# Altium schematic sheet Dionysus_Buttons_LEDs.SchDoc: Leds and Buttons
size B; CompanyName: Cospan Design; DrawnBy: David McCoy; Engineer: David McCoy; DocumentNumber: 7; Revision: B; SheetNumber: 7; SheetTotal: 8
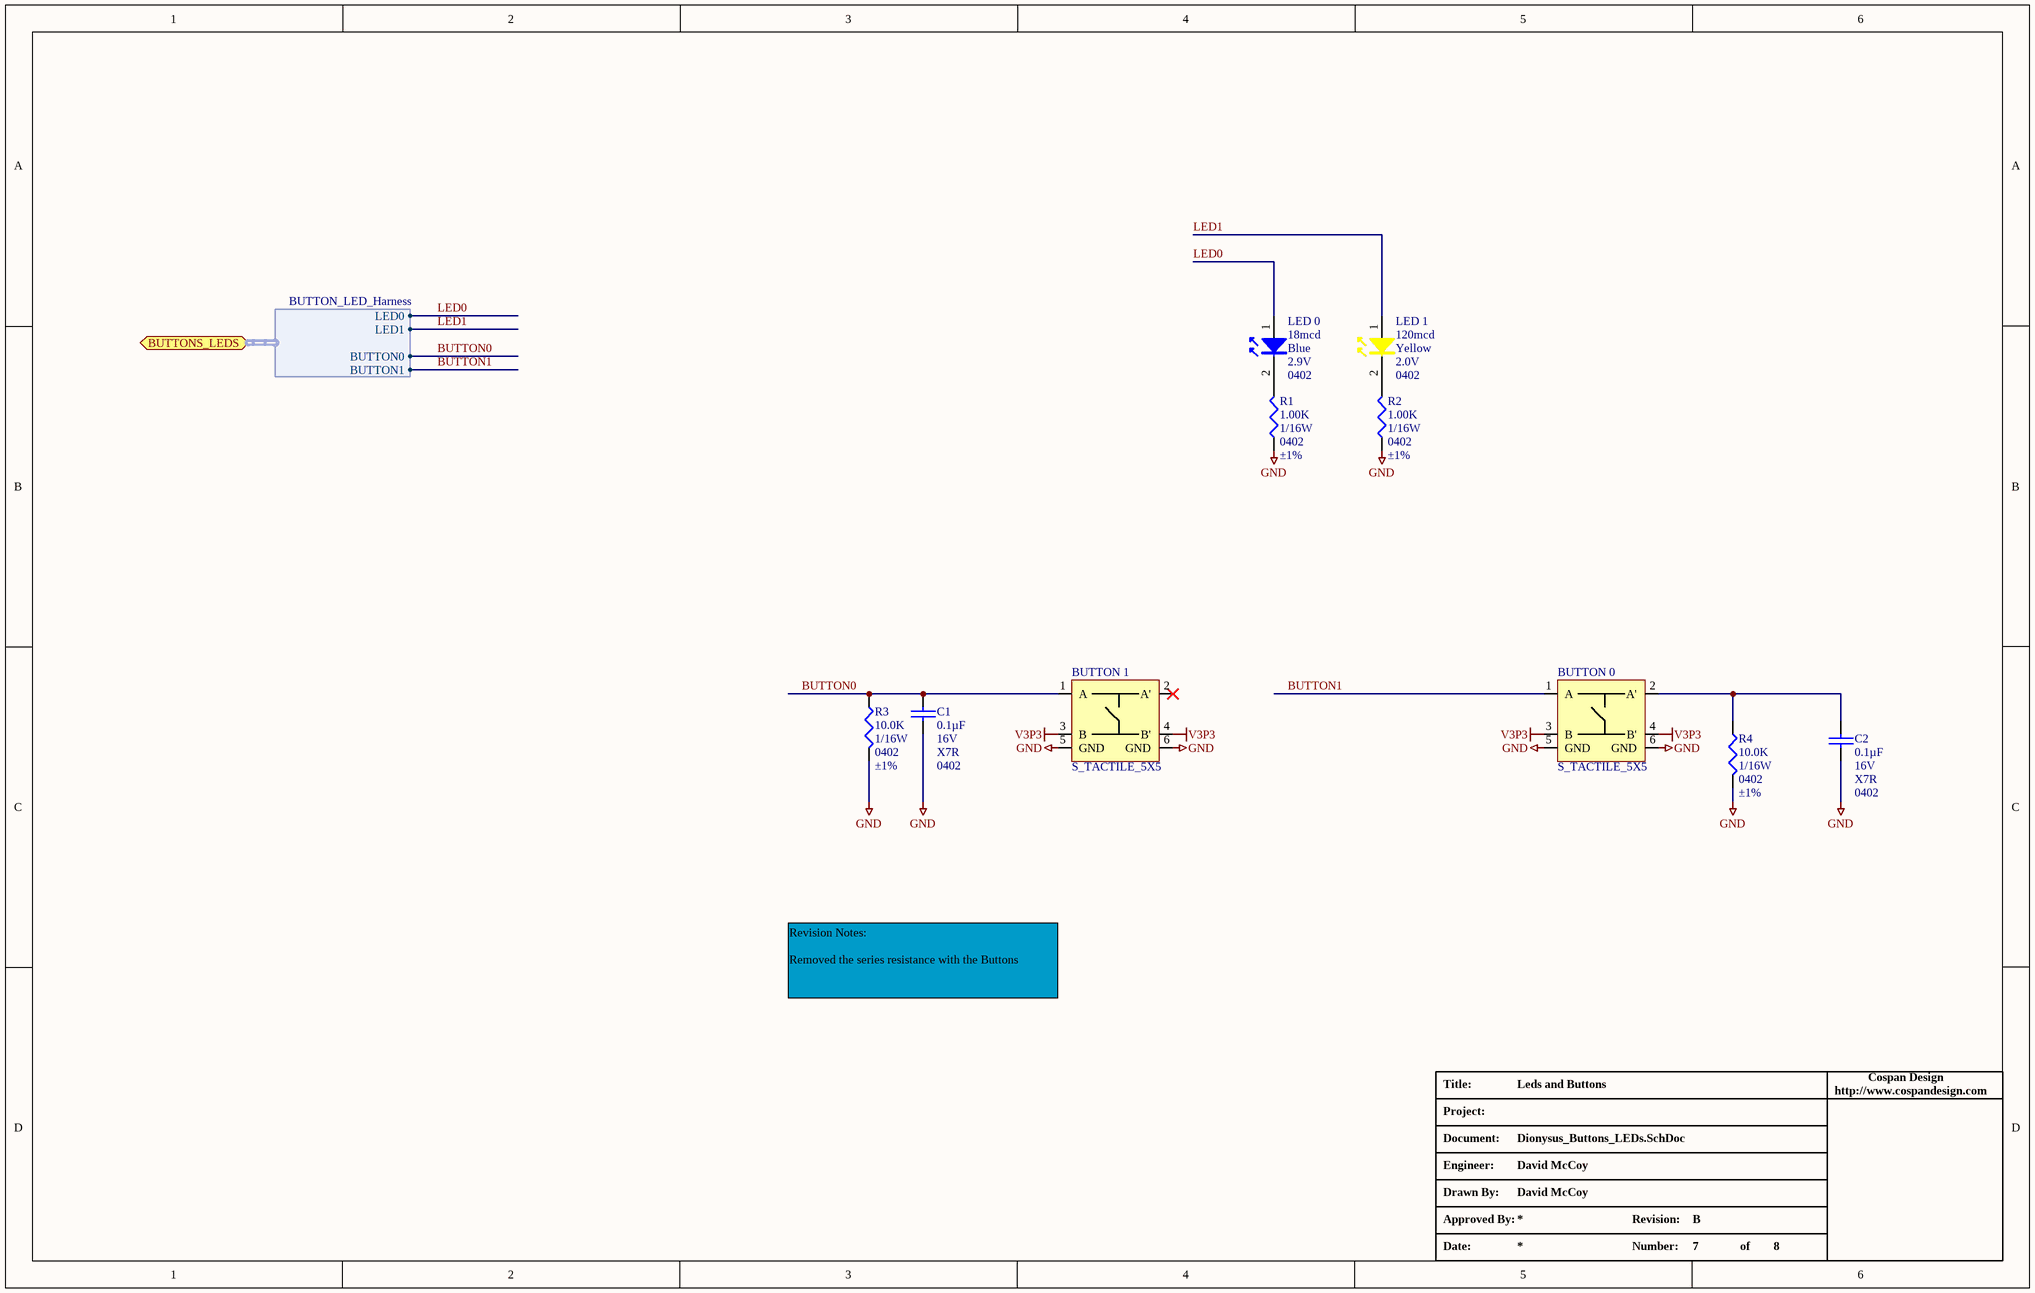
[diagram p0: Dionysus_Buttons_LEDs.SchDoc]

## Parts
BUTTON_0  S_TACTILE_5X5  [TACTILE_BUTTON_5X5]
BUTTON_1  S_TACTILE_5X5  [TACTILE_BUTTON_5X5]
C1  Capacitance: 0.1µF  Voltage - Rated: 16V  Temperature Coefficient: X7R  Package / Case: 0402  [C_ERA-0402]  (hidden comment: 0.1uF)
C2  Capacitance: 0.1µF  Voltage - Rated: 16V  Temperature Coefficient: X7R  Package / Case: 0402  [C_ERA-0402]  (hidden comment: 0.1uF)
LED_0  Luminous Flux @ Current - Test: 18mcd  Color: Blue  Voltage - Forward (Vf) Typ: 2.9V  Package / Case: 0402  [DIOM1005X07L_BLUE]  (hidden comment: LED_BLUE_0402)
LED_1  Millicandela Rating: 120mcd  Color: Yellow  Voltage - Forward (Vf) Typ: 2.0V  Package / Case: 0402  [DIOM1005X07L_YELLOW]  (hidden comment: LED_YLW_0402)
R1  Resistance In Ohms: 1.00K  Power (Watts): 1/16W  Case: 0402  Tolerance: ±1%  [ERA-0402]  (hidden comment: 1.0k Ohms)
R2  Resistance In Ohms: 1.00K  Power (Watts): 1/16W  Case: 0402  Tolerance: ±1%  [ERA-0402]  (hidden comment: 1.0k Ohms)
R3  Resistance In Ohms: 10.0K  Power (Watts): 1/16W  Case: 0402  Tolerance: ±1%  [ERA-0402]  (hidden comment: R_0402_10.0K)
R4  Resistance In Ohms: 10.0K  Power (Watts): 1/16W  Case: 0402  Tolerance: ±1%  [ERA-0402]  (hidden comment: R_0402_10.0K)

## Ports
BUTTONS_LEDS (harness BUTTON_LED_Harness)

## Harnesses
BUTTON_LED_Harness: LED0, LED1, BUTTON0, BUTTON1

## Nets
GND: BUTTON_0.5(GND) BUTTON_0.6(GND) BUTTON_1.5(GND) BUTTON_1.6(GND) C1.1 C2.1 R1.2 R2.2 R3.1 R4.1
V3P3: BUTTON_0.3(B) BUTTON_0.4(B') BUTTON_1.3(B) BUTTON_1.4(B')
BUTTON0: BUTTON_1.1(A) C1.2 R3.2 ; port BUTTONS_LEDS.BUTTON0
BUTTON1: BUTTON_0.1(A) ; port BUTTONS_LEDS.BUTTON1
LED0: LED_0.1 ; port BUTTONS_LEDS.LED0
LED1: LED_1.1 ; port BUTTONS_LEDS.LED1
NetBUTTON_0_2: BUTTON_0.2(A') C2.2 R4.2
NetLED_0_2: LED_0.2 R1.1
NetLED_1_2: LED_1.2 R2.1

Not connected (* = marked no-connect by the designer): BUTTON_1 2(A')*

## Notes on the sheet
- Revision Notes:
  Removed the series resistance with the Buttons
- Title:
- http://www.cospandesign.com
- Cospan Design
- Project:
- Document:
- Engineer:
- Drawn By:
- Approved By:
- Revision:
- Date:
- Number:
- of

## Library data of the parts
BUTTON_0 BUTTON_1 = S_TACTILE_5X5: SWITCH LT 1.5MM HT 160GF SMD; Manufacturer: Panasonic - ECG; Manufacturer Part Number: EVQ-PLHA15; Circuit: SPST-NO; Switch Function: Off-Mom; Contact Rating @ Voltage: 0.02A @ 15VDC; Actuator Type: Standard; Outline: 4.90mm x 4.90mm; Illumination: Non-Illuminated; Supplier 1: Digi-Key; Supplier Part Number 1: P8046SCT-ND; RoHS: RoHS Compliant; Category: Switches; Stock 1: 86833; Pricing: 1=0.53, 10=0.443, 100=0.3717, 500=0.3186, 1000=0.2655 (USD); Mounting Type: Surface Mount; Orientation: Vertical; Operating Force: 160gf; Packaging: Cut Tape (CT); ComponentLink1URL: http://industrial.panasonic.com/www-data/pdf/ATK0000/ATK0000CE3.pdf; ComponentLink1Description: http://industrial.panasonic.com/www-data/pdf/ATK0000/ATK0000CE3.pdf
C1 C2 = C_0402_0.1UF_16V: CAP CER .10UF 16V X7R 0402; Manufacturer: TDK Corporation; Manufacturer Part Number: C1005X7R1C104K; Tolerance: ±10%; Supplier 1: Digi-Key; Supplier Part Number 1: 445-4952-1-ND; RoHS: RoHS Compliant; Category: Capacitors; Stock 1: 230800; Pricing: 10=0.024, 100=0.0143, 500=0.00826, 1000=0.00572 (USD); Mounting Type: Surface Mount, MLCC; Features: General Purpose; Lead Spacing: -; Thickness: 0.50mm; Packaging: Cut Tape (CT); ComponentLink1URL: http://www.tdk.co.jp/tefe02/e412_c.pdf; ComponentLink1Description: http://www.tdk.co.jp/tefe02/e412_c.pdf; Operating Temperature: -55°C ~ 125°C
LED_0 = LED_BLUE_0402: LED 1X0.5MM 470NM BL WTR CLR SMD; Manufacturer: Panasonic - SSG; Manufacturer Part Number: LNJ947W8CRA; Description: LED BLUE RECTANGLE SMD; Current - Test: 5mA; Wavelength - Dominant: 472nm; Wavelength - Peak: 465nm; Lens Style/Size: Rectangle with Flat Top, 0.7mm x 0.5mm; Supplier 1: Digi-Key; RoHS: RoHS Compliant; Category: Optoelectronics; Stock 1: 8000; Pricing: 8000=0.1116, 16000=0.1044, 32000=0.09576, 56000=0.0918 (USD); Millicandela Rating: 18mcd; Lens Type: -; Mounting Type: Surface Mount; Viewing Angle: -; Packaging: Tape & Reel (TR); ComponentLink1URL: http://industrial.panasonic.com/www-cgi/jvcr13pz.cgi?E+SC+4+ATA7003+LNJ947W8CRA+8+WW; ComponentLink1Description: http://industrial.panasonic.com/www-cgi/jvcr13pz.cgi?E+SC+4+ATA7003+LNJ947W8CRA+8+WW; Supplier Part Number 1: LNJ947W8CRATR-ND; Size / Dimension: 1.00mm L x 0.50mm W; Height: 0.20mm
LED_1 = LED_YLW_0402: LED 1X0.5MM 590NM YW WTR CLR SMD; Manufacturer: Kingbright Corp; Manufacturer Part Number: APHHS1005SYCK; Luminous Flux @ Current - Test: 377 mlm; Current - Test: 20mA; Lens Type: Clear; Lens Style/Size: Rectangle, 0.8mm x 0.5mm; Viewing Angle: 120°; Supplier 1: Digi-Key; RoHS: RoHS Compliant; Category: Optoelectronics; Stock 1: 15829; Pricing: 1=0.26, 10=0.195, 25=0.156, 100=0.143, 250=0.13, 500=0.117, 1000=0.104 (USD); Wavelength - Dominant: 590nm; Wavelength - Peak: 590nm; Mounting Type: Surface Mount; Packaging: Cut Tape (CT); ComponentLink1URL: http://www.us.kingbright.com/images/catalog/SPEC/APHHS1005SYCK.pdf; ComponentLink1Description: http://www.us.kingbright.com/images/catalog/SPEC/APHHS1005SYCK.pdf; Supplier Part Number 1: 754-1105-1-ND
R1 R2 = R_0402_1.0K: RES 1.00K OHM 1/16W 1% 0402 SMD; Manufacturer: Yageo; Manufacturer Part Number: RC0402FR-071KL; Resistance (Ohms): 1K; Temperature Coefficient: ±100ppm/°C; Supplier 1: Digi-Key; Supplier Part Number 1: 311-1.00KLRCT-ND; RoHS: RoHS Compliant; Category: Resistors; Stock 1: 2103351; Pricing: 10=0.014, 100=0.0063, 500=0.00382, 1000=0.0027, 5000=0.00203 (USD); Composition: Thick Film; Features: -; Package / Case: 0402 (1005 Metric); Size / Dimension: 0.039" L x 0.020" W (1.00mm x 0.50mm); Height: 0.016" (0.40mm); Number of Terminations: 2; Packaging: Cut Tape (CT); ComponentLink1URL: http://www.yageo.com/documents/recent/PYu-RC0402_51_RoHS_L_6.pdf; ComponentLink1Description: http://www.yageo.com/documents/recent/PYu-RC0402_51_RoHS_L_6.pdf
R3 R4 = R_0402_10.0K: RES 10.0K OHM 1/16W 1% 0402 SMD; Manufacturer: Stackpole Electronics Inc; Manufacturer Part Number: RMCF0402FT10K0; Description: RES 10K OHM 1/16W 1% 0402 SMD; Temperature Coefficient: ±100ppm/°C; Resistance (Ohms): 10k; Supplier 1: Digi-Key; Supplier Part Number 1: RMCF0402FT10K0CT-ND; RoHS: RoHS Compliant; Category: Resistors; Stock 1: 234525; Pricing: 1=0.04, 10=0.025, 50=0.0138, 100=0.0105, 250=0.0078, 500=0.00576, 1000=0.00384, 2500=0.00324, 5000=0.0027 (USD); Composition: Thick Film; Features: -; Packaging: Cut Tape (CT); ComponentLink1URL: http://www.seielect.com/Catalog/SEI-RMCF_RMCP.pdf; ComponentLink1Description: http://www.seielect.com/Catalog/SEI-RMCF_RMCP.pdf; Package / Case: 0402 (1005 Metric); Size / Dimension: 0.039" L x 0.020" W (1.00mm x 0.50mm); Height: 0.016" (0.40mm); Number of Terminations: 2